# Altium project 1-LightingAndSolenoidValve.PrjPcb
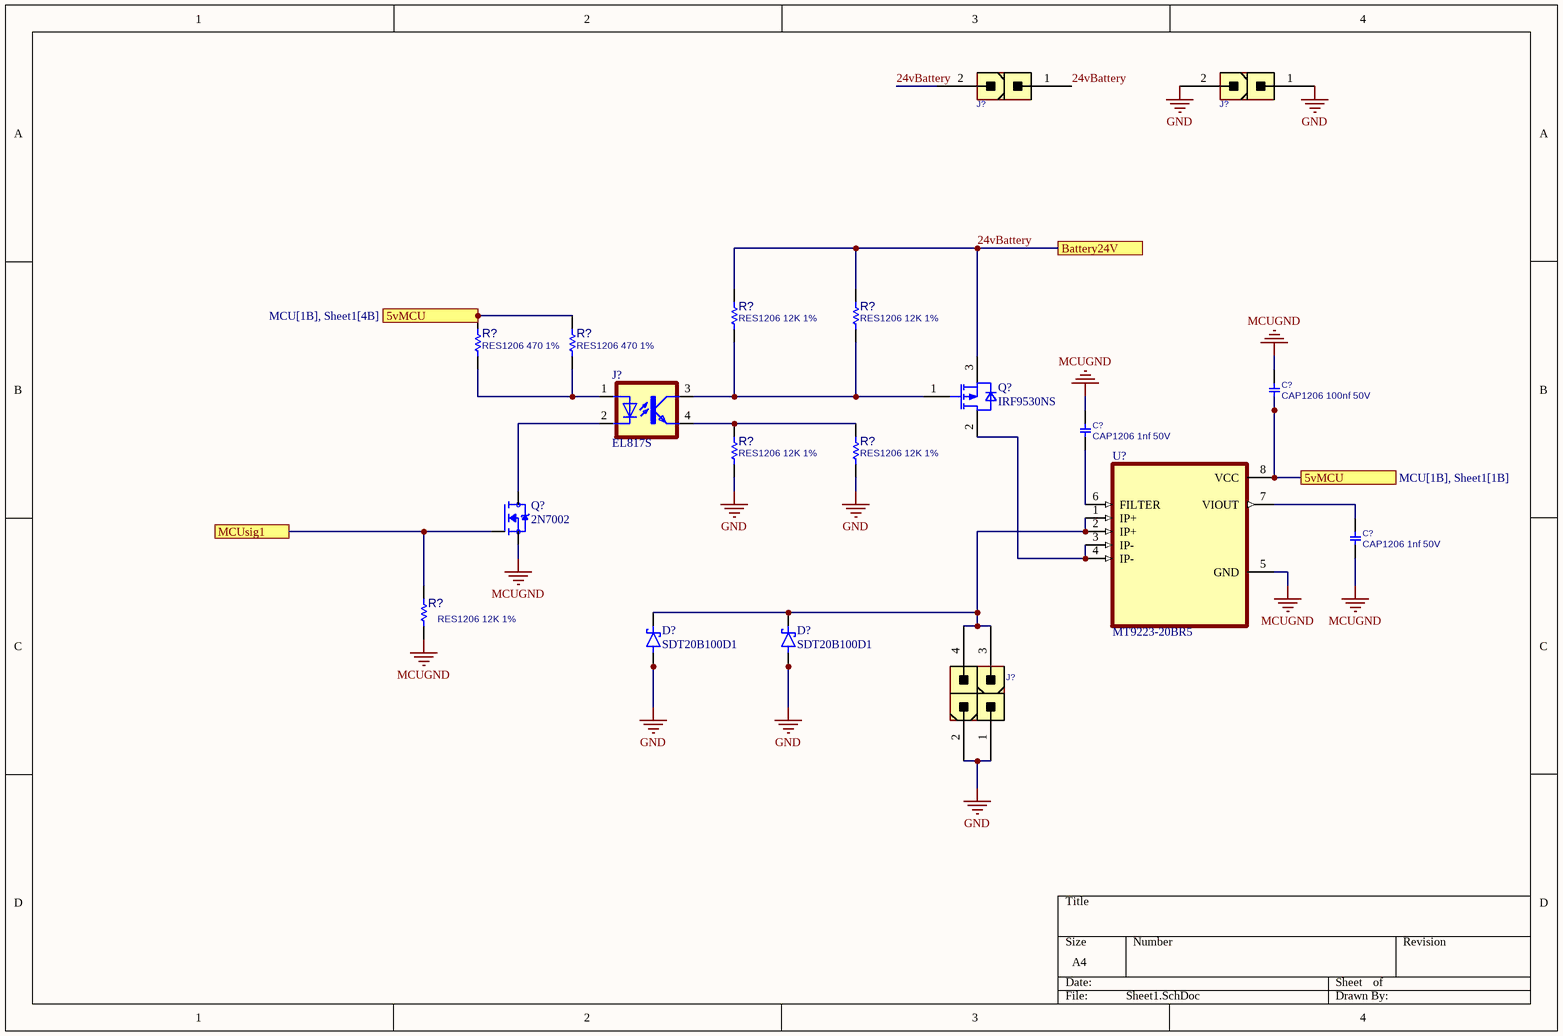
[diagram p0: Sheet1.SchDoc]
3 sheets, 47 parts. Net scope: flat (ports and power ports of the same name join across sheets).
Board file: PCB1.PcbDoc
Sheets:
  Sheet1.SchDoc
  MCU.SchDoc
  RS485.SchDoc

## Sheet Sheet1.SchDoc
size A4; SheetNumber: 1; SheetTotal: 3

### Parts
(Parts that share a designator on the sheet are numbered #1, #2 ... from top to bottom, then left to right.)
C?#1  CAP1206 100nf 50V  [C1206]
C?#2  CAP1206 1nf 50V  [C1206]
C?#3  CAP1206 1nf 50V  [C1206]
D?#1  SDT20B100D1  [DPAK229P990X238-3N]
D?#2  SDT20B100D1  [DPAK229P990X238-3N]
J?#1  CONN_ATXPWR_2  [ATXPWR_2]  (value not drawn)
J?#2  CONN_ATXPWR_2  [ATXPWR_2]  (value not drawn)
J?#3  EL817S  [SOIC254P1030X460-4N]
J?#4  CONN_ATXPWR_4  [ATXPWR_4]  (value not drawn)
Q?#1  IRF9530NS  [TO254P1528X508-4_3N-V1]
Q?#2  2N7002  [SOT95P240X111-3N]
R?#1  RES1206 12K 1%  [R1206]
R?#2  RES1206 12K 1%  [R1206]
R?#3  RES1206 470 1%  [R1206]
R?#4  RES1206 470 1%  [R1206]
R?#5  RES1206 12K 1%  [R1206]
R?#6  RES1206 12K 1%  [R1206]
R?#7  RES1206 12K 1%  [R1206]
U?#1  MT9223-20BR5  [SOIC127P600X175-8N]

### Ports
5vMCU (see MCU[1B], Sheet1[1B]), 5vMCU (see MCU[1B], Sheet1[4B]), Battery24V, MCUsig1

### Nets
GND: D?#1.1(A) D?#1.3(A__1) D?#2.1(A) D?#2.3(A__1) J?#2.1 J?#2.2 J?#4.1 J?#4.2 R?#5.2 R?#6.2
MCUGND: C?#1.1 C?#2.2 C?#3.2 Q?#2.2(S) R?#7.2 U?#1.5(GND)
5vMCU: C?#1.2 R?#3.2 R?#4.2 U?#1.8(VCC) ; port 5vMCU
24vBattery: J?#1.1 J?#1.2 Q?#1.3(SOURCE) R?#1.1 R?#2.1 ; port Battery24V
NetC?#2_1: C?#2.1 U?#1.6(FILTER)
NetC?#3_1: C?#3.1 U?#1.7(VIOUT)
NetD?#1_4: D?#1.4(K) D?#2.4(K) J?#4.3 J?#4.4 U?#1.1(IP+) U?#1.2(IP+)
NetJ?#3_1: J?#3.1(A) R?#3.1 R?#4.1
NetJ?#3_2: J?#3.2(C) Q?#2.3(D)
NetJ?#3_3: J?#3.3(COL) Q?#1.1(GATE) R?#1.2 R?#2.2
NetJ?#3_4: J?#3.4(EMIT) R?#5.1 R?#6.1
NetQ?#1_2: Q?#1.2(DRAIN) U?#1.3(IP-) U?#1.4(IP-)
NetQ?#2_1: Q?#2.1(G) R?#7.1 ; port MCUsig1

### Library data of the parts
C?#1-C?#3 = CAP_SMD_MLCC_1206: CAP, MLCC; PARAM: -, -%; MANF_P#: MANF_PART#; PARAM2: -V; PRICE: 100= 1$; MANF: -; ASSEMBLY: ASSEMBLY
D?#1 D?#2 = MBRD835L: Diode Schottky 35 V 8A Surface Mount DPAK; MF: ON Semiconductor; SnapEDA_Link: https://www.snapeda.com/parts/MBRD835L/Onsemi/view-part/?ref=snap; Package: TO-252-3 MICROSS/On Semiconductor; Value: *; MP: MBRD835L; Check_prices: https://www.snapeda.com/parts/MBRD835L/Onsemi/view-part/?ref=eda
J?#1 J?#2 = CONN_ATXPWR_2: CONN, ATX POWER, 2 P; MANF: Molex; MANF_P#: 39281023; VALUE: CONN_ATXPWR_2; MountType: THD; PACKAGE: ATXPWR-2pin; Part Type: Conn.
J?#3 = EL817S: Optoisolator Transistor Output 5000Vrms 1 Channel 4-SMD; MF: Everlight Electronics; SnapEDA_Link: https://www.snapeda.com/parts/EL817S/Everlight+Electronics+Co+Ltd/view-part/?ref=snap; Package: SMD-4 Everlight Electronics Co Ltd; Value: *; MP: EL817S; Check_prices: https://www.snapeda.com/parts/EL817S/Everlight+Electronics+Co+Ltd/view-part/?ref=eda
J?#4 = CONN_ATXPWR_4: CONN, ATX POWER, 4 P; MANF: TE, Molex; MANF_P#: 4-1775099-0, 39281043; VALUE: CONN_ATXPWR_4; MountType: THD; PACKAGE: ATXPWR-4pin; Part Type: Conn.
Q?#1 = IRF9530NS: OptiMOS - P2 Power-Transistor, P-channel-Enhancement mode, VDS -30V; Manufacturer: Infineon Technologies; Manufacturer Order NumberManufacturer Order Number: IRF9530NS; PackageReference: PG-TO263-3-901
Q?#2 = 2N7002: N-Channel 60V 280mA (Ta) 350mW (Ta) Surface Mount SOT-23-3 (TO-236); MF: {'manufacturer': u'onsemi'}; Package: None; Price: None; Value: *; MP: 2N7002; Availability: Unavailable
R?#1-R?#7 = RES_SMD_1206: RESISTOR, SMD; PARAM: 1%, 0.25W; DESC: DESCRIPTION; DIST#: MOUSER; MANF_P#: -; MANF: -; ASSEMBLY: ASSEMBLY; PRICE: -; PARAM2: -
U?#1 = ACS712ELCTR-05B-T: MF: {'manufacturer': u'Allegro MicroSystems'}; Package: None; Price: None; Value: *; MP: ACS712ELCTR-05B-T; Availability: Unavailable

## Sheet MCU.SchDoc
size A4; DocumentNumber: 1; SheetNumber: 2; SheetTotal: 3
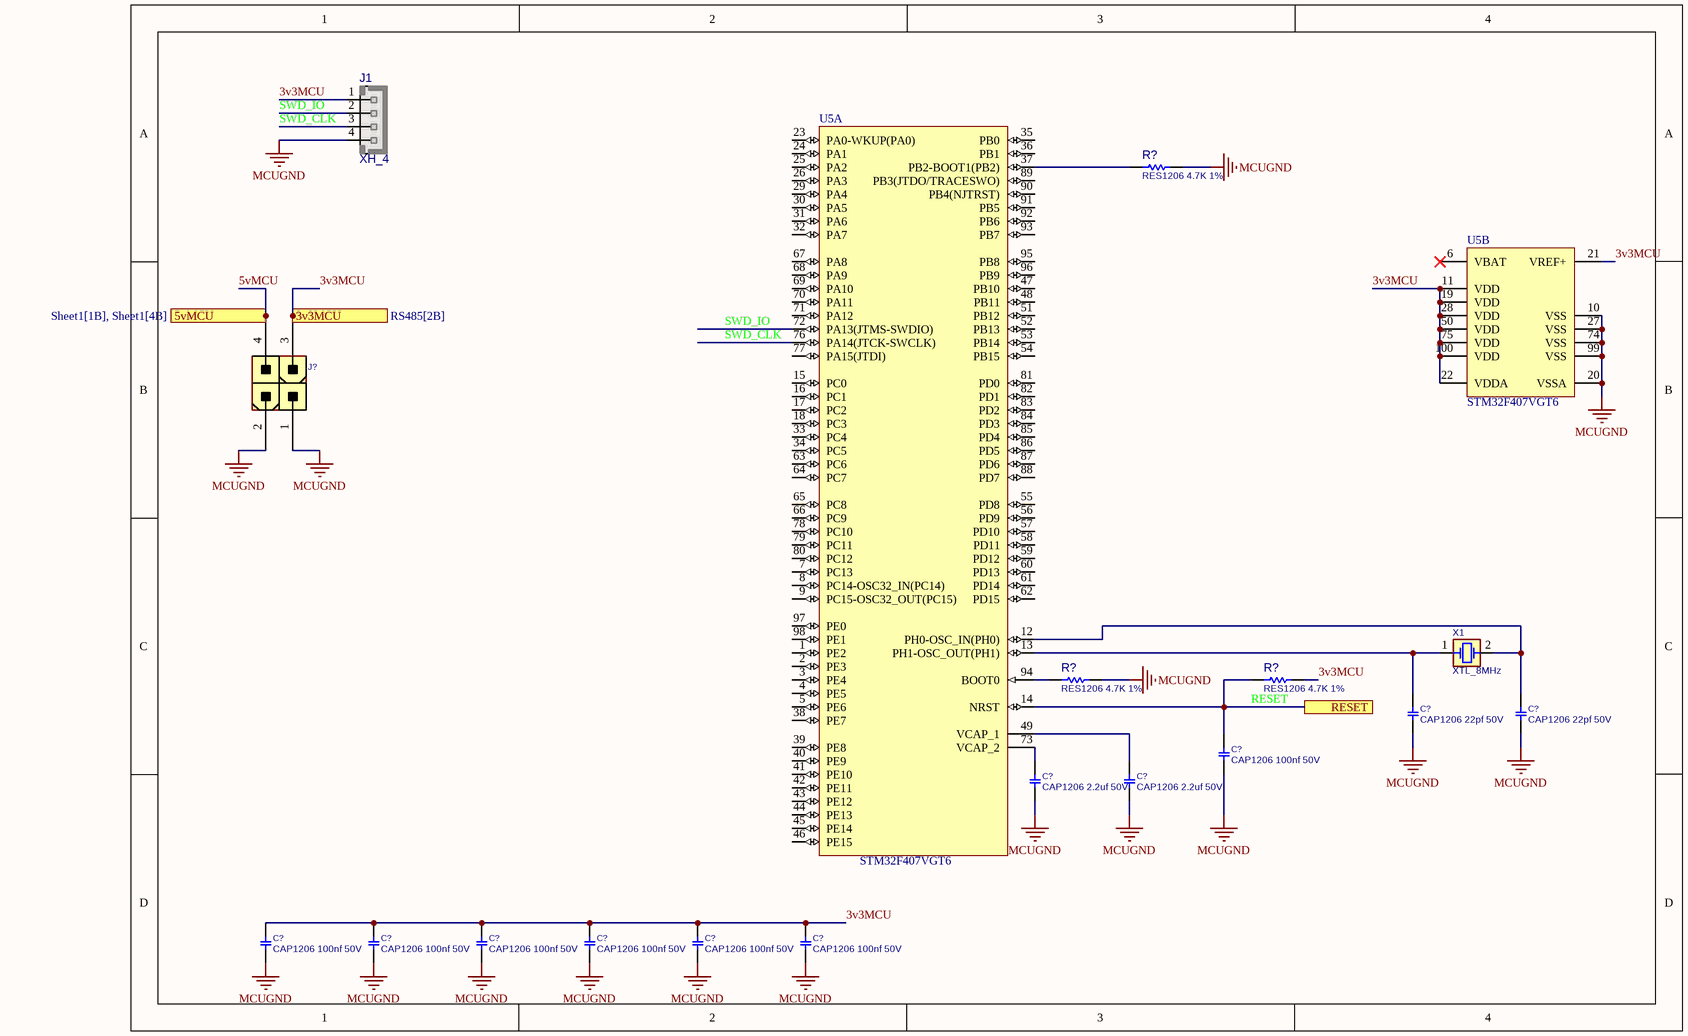
[diagram p1: MCU.SchDoc]

### Parts
(Parts that share a designator on the sheet are numbered #1, #2 ... from top to bottom, then left to right.)
C?#4  CAP1206 22pf 50V  [C1206]
C?#5  CAP1206 22pf 50V  [C1206]
C?#6  CAP1206 100nf 50V  [C1206]
C?#7  CAP1206 2.2uf 50V  [C1206]
C?#8  CAP1206 2.2uf 50V  [C1206]
C?#9  CAP1206 100nf 50V  [C1206]
C?#10  CAP1206 100nf 50V  [C1206]
C?#11  CAP1206 100nf 50V  [C1206]
C?#12  CAP1206 100nf 50V  [C1206]
C?#13  CAP1206 100nf 50V  [C1206]
C?#14  CAP1206 100nf 50V  [C1206]
J1  XH_4  [XH_4]
J?#5  CONN_ATXPWR_4  [ATXPWR_4]  (value not drawn)
R?#8  RES1206 4.7K 1%  [R1206]
R?#9  RES1206 4.7K 1%  [R1206]
R?#10  RES1206 4.7K 1%  [R1206]
U5  STM32F407VGT6  [STM-LQFP100_N]  (parts A,B of 2)
X1  XTL_8MHz  [XTL_2_11X5]

### Ports
3v3MCU (see RS485[2B]), 5vMCU (see Sheet1[1B], Sheet1[4B]), RESET

### Nets
MCUGND: C?#4.1 C?#5.1 C?#6.1 C?#7.1 C?#8.1 C?#9.1 C?#10.1 C?#11.1 C?#12.1 C?#13.1 C?#14.1 J1.4 J?#5.1 J?#5.2 R?#8.2 R?#9.2 U5.10(VSS) U5.20(VSSA) U5.27(VSS) U5.74(VSS) U5.99(VSS)
3v3MCU: C?#9.2 C?#10.2 C?#11.2 C?#12.2 C?#13.2 C?#14.2 J1.1 J?#5.3 R?#10.2 U5.11(VDD) U5.19(VDD) U5.21(VREF+) U5.22(VDDA) U5.28(VDD) U5.50(VDD) U5.75(VDD) U5.100(VDD) ; port 3v3MCU
5vMCU: J?#5.4 ; port 5vMCU
RESET: C?#6.2 R?#10.1 U5.14(NRST) ; port RESET
SWD_CLK: J1.3 U5.76(PA14(JTCK-SWCLK))
SWD_IO: J1.2 U5.72(PA13(JTMS-SWDIO))
NetC?#4_2: C?#4.2 U5.13(PH1-OSC_OUT(PH1)) X1.1(OSC1)
NetC?#5_2: C?#5.2 U5.12(PH0-OSC_IN(PH0)) X1.2(OSC2)
NetC?#7_2: C?#7.2 U5.73(VCAP_2)
NetC?#8_2: C?#8.2 U5.49(VCAP_1)
NetR?#8_1: R?#8.1 U5.37(PB2-BOOT1(PB2))
NetR?#9_1: R?#9.1 U5.94(BOOT0)

Not connected (* = marked no-connect by the designer): U5 1(PE2) 2(PE3) 3(PE4) 4(PE5) 5(PE6) 6(VBAT)* 7(PC13) 8(PC14-OSC32_IN(PC14)) 9(PC15-OSC32_OUT(PC15)) 15(PC0) 16(PC1) 17(PC2) 18(PC3) 23(PA0-WKUP(PA0)) 24(PA1) 25(PA2) 26(PA3) 29(PA4) 30(PA5) 31(PA6) 32(PA7) 33(PC4) 34(PC5) 35(PB0) 36(PB1) 38(PE7) 39(PE8) 40(PE9) 41(PE10) 42(PE11) 43(PE12) 44(PE13) 45(PE14) 46(PE15) 47(PB10) 48(PB11) 51(PB12) 52(PB13) 53(PB14) 54(PB15) 55(PD8) 56(PD9) 57(PD10) 58(PD11) 59(PD12) 60(PD13) 61(PD14) 62(PD15) 63(PC6) 64(PC7) 65(PC8) 66(PC9) 67(PA8) 68(PA9) 69(PA10) 70(PA11) 71(PA12) 77(PA15(JTDI)) 78(PC10) 79(PC11) 80(PC12) 81(PD0) 82(PD1) 83(PD2) 84(PD3) 85(PD4) 86(PD5) 87(PD6) 88(PD7) 89(PB3(JTDO/TRACESWO)) 90(PB4(NJTRST)) 91(PB5) 92(PB6) 93(PB7) 95(PB8) 96(PB9) 97(PE0) 98(PE1)

### Library data of the parts
C?#4-C?#14 = CAP_SMD_MLCC_1206: as C?#1 on sheet Sheet1; PRICE: 100= 1$; MANF: -; ASSEMBLY: ASSEMBLY
J1 = XH_4: PW10-x-M, JST-BxB-XH-A pitch: 2.5mm, 3A/250v; MANF: JST; MANF_P#: B4B-XH-A; PARAM2: 250v; PARAM: 3.0A; VALUE: XH_4
J?#5 = CONN_ATXPWR_4: as J?#4 on sheet Sheet1; VALUE: CONN_ATXPWR_4; MountType: THD; PACKAGE: ATXPWR-4pin; Part Type: Conn.
R?#8-R?#10 = RES_SMD_1206: as R?#1 on sheet Sheet1; MANF_P#: -; MANF: -; ASSEMBLY: ASSEMBLY; PRICE: -; PARAM2: -
U5 = STM32F407VGT6: ARM Cortex-M4 32-bit MCU+FPU, 210 DMIPS, 1024 kB Flash, 192 kB Internal RAM, 82 I/Os, 100-pin LQFP, -40 to 85 degC, Tray; Manufacturer: STMicroelectronics; D/A Converter: 2x12-bit; FLASH Size (Prog) (kB): 1024; I/Os (High Current): 82; Internal RAM Size (kB): 192; Operating Frequency(F) (Processor speed) (MHz): 168; Supply Voltage(Vcc) max (V): 3.6; Supply Voltage(Vcc) min (V): 1.8; DatasheetVersion: Rev. 4; PackageVersion: Rev. 1, 06/2013; PackageReference: LQFP100; PackageDescription: 100-Pin Low Profile Quad Flat Package, 14 x 14 mm Body, 0.5 mm Pitch; Supplier 1: Digi-Key; Supplier Part Number 1: 497-11605-ND; Supplier 2: Farnell; Supplier Part Number 2: 2064368; Supplier 3: Newark; Supplier Part Number 3: 73T2333; Supplier 4: Mouser; Supplier Part Number 4: 511-STM32F407VGT6; Core: ARM Cortex-M4; Packing: Tray; Mounting Technology: Surface Mount; PartNumber: STM32F407VGT6; ComponentLink1Description: Manufacturer URL; ComponentLink1URL: http://www.st.com/web/en/home.html; ComponentLink2Description: Datasheet; ComponentLink2URL: http://www.st.com/st-web-ui/static/active/en/resource/technical/document/datasheet/DM00037051.pdf; ComponentLink3Description: Package Specification; ComponentLink3URL: http://www.st.com/st-web-ui/static/active/en/resource/technical/document/data_brief/DM00071938.pdf
X1 = XTL_2_HC49_8MHz_SMD: Crystal MOST POPULAR ABL HC49 PACKAGE; MANF: ABRACON; MANF_P#: ABLS-8.000MHZ-B4-T; PARAM: 8MHz, 18pF, 30PPM, -20~70oC; PRICE: 0.3$; VALUE: XTL_8MHz

## Sheet RS485.SchDoc
size A4; SheetNumber: 3; SheetTotal: 3
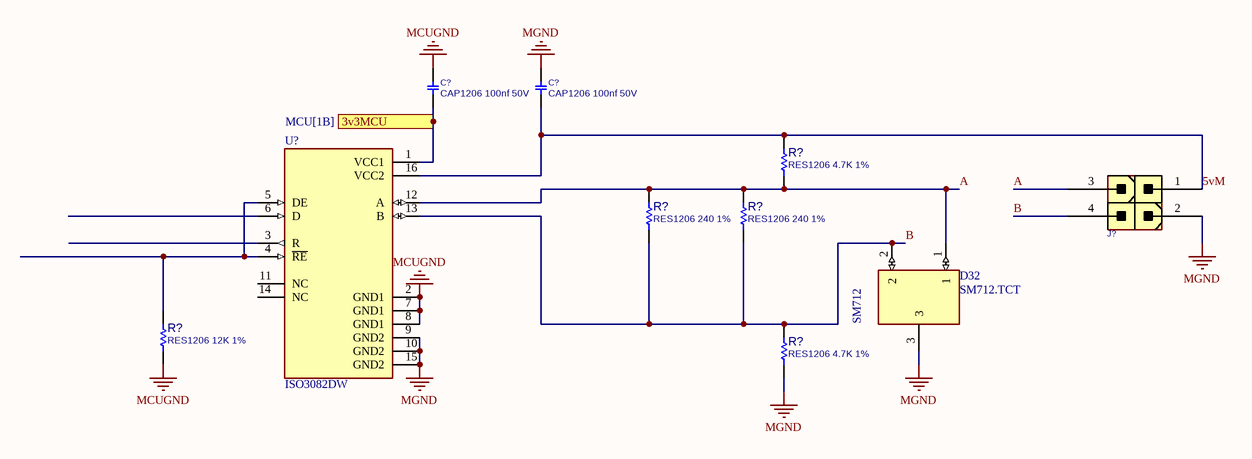
[diagram p2: RS485.SchDoc]

### Parts
(Parts that share a designator on the sheet are numbered #1, #2 ... from top to bottom, then left to right.)
C?#15  CAP1206 100nf 50V  [C1206]
C?#16  CAP1206 100nf 50V  [C1206]
D32  SM712.TCT  [SOT23]
J?#6  CONN_ATXPWR_4  [ATXPWR_4]  (value not drawn)
R?#11  RES1206 4.7K 1%  [R1206]
R?#12  RES1206 240 1%  [R1206]
R?#13  RES1206 240 1%  [R1206]
R?#14  RES1206 12K 1%  [R1206]
R?#15  RES1206 4.7K 1%  [R1206]
U?#2  ISO3082DW  [SOIC127P1030X265-16N]

### Ports
3v3MCU (see MCU[1B])

### Nets
MCUGND: C?#15.1 R?#14.1 U?#2.2(GND1) U?#2.7(GND1) U?#2.8(GND1)
MGND: C?#16.1 D32.3 J?#6.2 R?#15.1 U?#2.9(GND2) U?#2.10(GND2) U?#2.15(GND2)
3v3MCU: C?#15.2 U?#2.1(VCC1) ; port 3v3MCU
5vM: C?#16.2 J?#6.1 R?#11.2 U?#2.16(VCC2)
A: D32.1 J?#6.3 R?#11.1 R?#12.2 R?#13.2 U?#2.12(A)
B: D32.2 J?#6.4 R?#12.1 R?#13.1 R?#15.2 U?#2.13(B)
NetR?#14_2: R?#14.2 U?#2.4(~{RE}) U?#2.5(DE)

Not connected (* = marked no-connect by the designer): U?#2 3(R) 6(D) 11(NC) 14(NC)

### Notes on the sheet
- (in symbol SM712.TCT) SM712

### Library data of the parts
C?#15 C?#16 = CAP_SMD_MLCC_1206: as C?#1 on sheet Sheet1; PRICE: 100= 1$; MANF: -; ASSEMBLY: ASSEMBLY
D32 = SM712.TCT: SM Series 12 V 400 W Asymmetrical TVS Diode for Extended Common-Mode - SOT-23; MF: Semtech Corporation; SnapEDA_Link: https://www.snapeda.com/parts/SM712.TCT/Semtech/view-part/?ref=snap; Package: SOT-23 Semtech; Value: *; MP: SM712.TCT; Check_prices: https://www.snapeda.com/parts/SM712.TCT/Semtech/view-part/?ref=eda
J?#6 = CONN_ATXPWR_4: as J?#4 on sheet Sheet1; VALUE: CONN_ATXPWR_4; MountType: THD; PACKAGE: ATXPWR-4pin; Part Type: Conn.
R?#11-R?#15 = RES_SMD_1206: as R?#1 on sheet Sheet1; MANF_P#: -; MANF: -; ASSEMBLY: ASSEMBLY; PRICE: -; PARAM2: -
U?#2 = ISO3082DW: 200-Kbps, half-duplex, 2.5-kVrms isolated RS-485 & RS-422 transceiver; MF: Texas Instruments; SnapEDA_Link: https://www.snapeda.com/parts/ISO3082DW/Texas+Instruments/view-part/?ref=snap; Package: SOIC-16 Texas Instruments; Value: *; MP: ISO3082DW; Check_prices: https://www.snapeda.com/parts/ISO3082DW/Texas+Instruments/view-part/?ref=eda

## Nets that join several sheets
MCUGND: Sheet1 (6 pins), MCU (21 pins), RS485 (5 pins)
3v3MCU: MCU (17 pins), RS485 (C?#15.2 U?#2.1)
5vMCU: Sheet1 (C?#1.2 R?#3.2 R?#4.2 U?#1.8), MCU (J?#5.4)